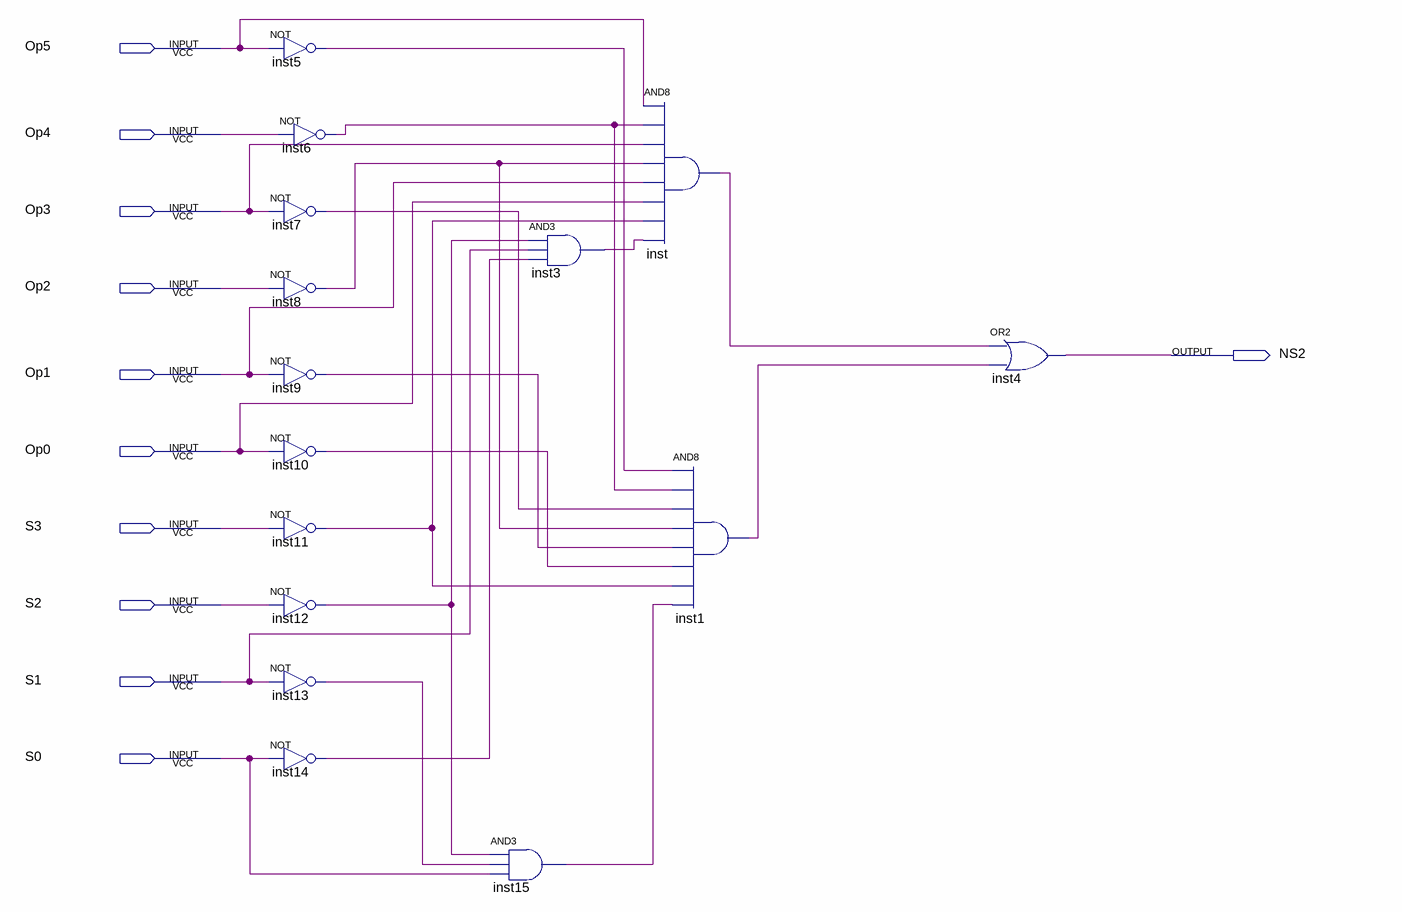
[diagram p0: schematic sheet]
// Quartus schematic NS2.bdf as structural Verilog: 15 symbols, 11 pins
module NS2 (
  input  Op5,
  input  Op4,
  input  Op3,
  input  Op2,
  input  Op1,
  input  Op0,
  input  S3,
  input  S2,
  input  S1,
  input  S0,
  output NS2
);

  wire inst1_out, inst3_out, inst5_out, inst6_out, inst7_out, inst8_out, inst9_out, inst10_out, inst11_out,
       inst12_out, inst13_out, inst14_out, inst15_out, inst_out;

  not inst5 (inst5_out, Op5);
  not inst6 (inst6_out, Op4);
  not inst7 (inst7_out, Op3);
  not inst8 (inst8_out, Op2);
  not inst9 (inst9_out, Op1);
  not inst10 (inst10_out, Op0);
  not inst11 (inst11_out, S3);
  not inst12 (inst12_out, S2);
  not inst13 (inst13_out, S1);
  not inst14 (inst14_out, S0);
  and inst3 (inst3_out, inst12_out, S1, inst14_out);
  and inst15 (inst15_out, inst12_out, inst13_out, S0);
  and inst (inst_out, Op5, inst6_out, Op3, inst8_out, Op1, Op0, inst11_out, inst3_out);
  and inst1 (inst1_out, inst5_out, inst6_out, inst7_out, inst8_out, inst9_out, inst10_out, inst11_out, inst15_out);
  or inst4 (NS2, inst_out, inst1_out);
endmodule
